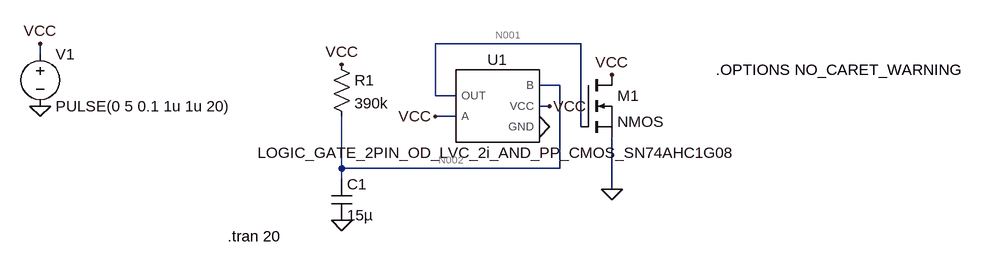
[diagram p0: schematic time.asc]
time.asc, the LTspice schematic file:
Version 4.1
SHEET 1 896 680
WIRE 304 48 80 48
WIRE -528 64 -528 48
WIRE 272 112 240 112
WIRE 80 128 80 48
WIRE 112 128 80 128
WIRE 256 144 240 144
WIRE 112 160 80 160
WIRE 304 176 304 48
WIRE -64 240 -64 160
WIRE 272 240 272 112
WIRE 272 240 -64 240
WIRE -64 256 -64 240
WIRE 352 272 352 192
FLAG -528 144 0
FLAG 256 144 VCC
FLAG -528 48 VCC
FLAG -64 80 VCC
FLAG -64 320 0
FLAG 80 160 VCC
FLAG 240 176 0
FLAG 352 272 0
FLAG 352 96 VCC
SYMBOL LOGIC_GATE_2PIN_OD_LVC_2i_AND_PP_CMOS_SN74AHC1G08 176 144 R0
SYMATTR InstName U1
SYMBOL voltage -528 48 R0
WINDOW 123 0 0 Left 0
WINDOW 39 0 0 Left 0
SYMATTR InstName V1
SYMATTR Value PULSE(0 5 0.1 1u 1u 20)
SYMBOL nmos 304 96 R0
SYMATTR InstName M1
SYMBOL res -80 64 R0
SYMATTR InstName R1
SYMATTR Value 390k
SYMBOL cap -80 256 R0
SYMATTR InstName C1
SYMATTR Value 15µ
TEXT -240 344 Left 2 !.tran 20
TEXT 512 88 Left 2 !.OPTIONS NO_CARET_WARNING

The netlist it stands for:
* time.asc
X§U1 N001 VCC N002 VCC 0 LOGIC_GATE_2PIN_OD_LVC_2i_AND_PP_CMOS_SN74AHC1G08  ; pins OUT A B VCC GND
V1 VCC 0 PULSE(0 5 0.1 1u 1u 20)
M1 VCC N001 0 0 NMOS
R1 VCC N002 390k
C1 N002 0 15µ
.model NMOS NMOS
.model PMOS PMOS
.lib standard.mos
.tran 20
.OPTIONS NO_CARET_WARNING
.lib SN74AHC1G08.cir
.backanno
.end

* Results of the author's LTspice run, read from the files saved beside the schematic
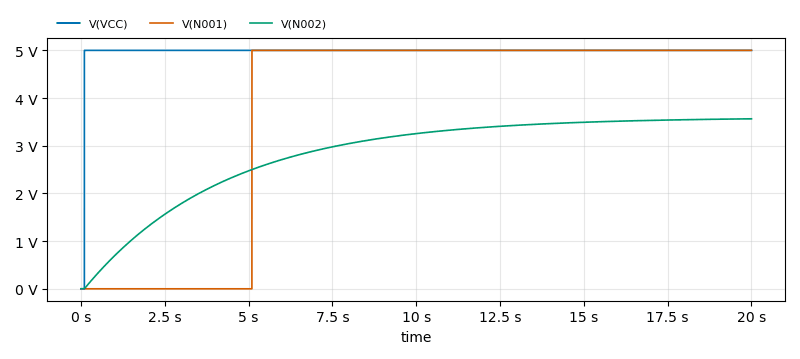
[diagram p1: Transient Analysis of time.asc, plotted from the saved traces]
* Transient Analysis, 1 run:
*   V(VCC): min 0 V, max 5 V, average 4.975 V, rms 4.987 V, last 5 V
*   V(N001): min 0 V, max 5 V, average 3.725 V, rms 4.316 V, last 5 V
*   V(N002): min 0 V, max 3.565 V, average 2.829 V, rms 2.973 V, last 3.565 V